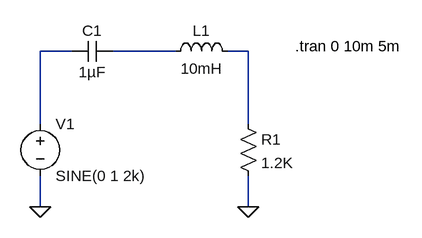
[diagram p0: schematic Problem3.asc]
Problem3.asc, the LTspice schematic file:
Version 4
SHEET 1 880 680
WIRE 288 192 240 192
WIRE 448 192 352 192
WIRE 560 192 528 192
WIRE 240 304 240 192
WIRE 560 304 560 192
WIRE 240 432 240 384
WIRE 560 432 560 384
FLAG 560 432 0
FLAG 240 432 0
SYMBOL voltage 240 288 R0
SYMATTR InstName V1
SYMATTR Value SINE(0 1 2k)
SYMBOL cap 352 176 R90
WINDOW 0 0 32 VBottom 2
WINDOW 3 32 32 VTop 2
SYMATTR InstName C1
SYMATTR Value 1µF
SYMBOL ind 432 208 R270
WINDOW 0 32 56 VTop 2
WINDOW 3 5 56 VBottom 2
SYMATTR InstName L1
SYMATTR Value 10mH
SYMBOL res 544 288 R0
SYMATTR InstName R1
SYMATTR Value 1.2K
TEXT 632 184 Left 2 !.tran 0 10m 5m

The netlist it stands for:
* Problem3.asc
V1 N001 0 SINE(0 1 2k)
C1 N002 N001 1µF
L1 N002 N003 10mH
R1 N003 0 1.2K
.tran 0 10m 5m
.backanno
.end